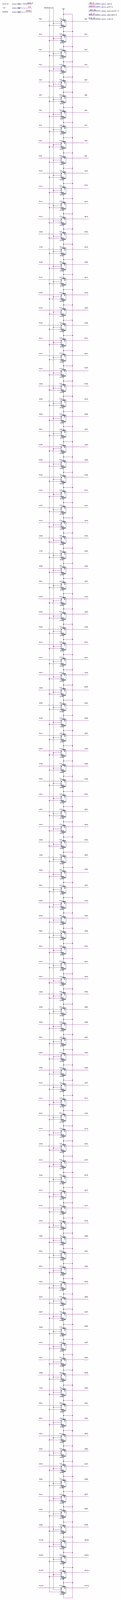
[diagram p0: schematic sheet, whole]
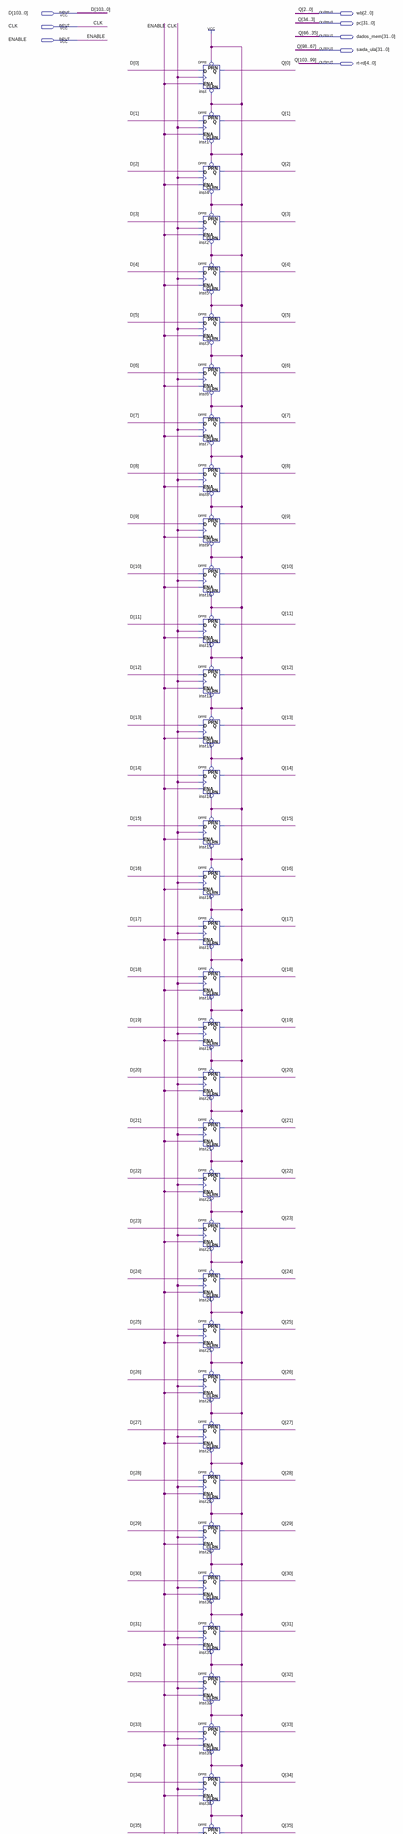
[diagram p1: schematic sheet, upper part]
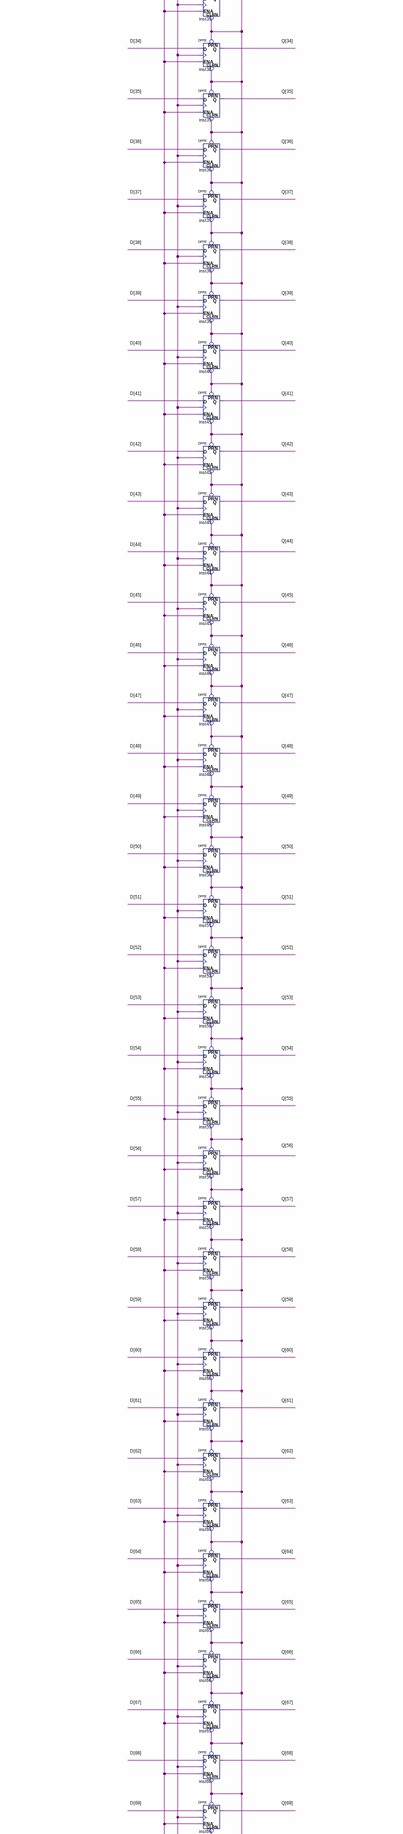
[diagram p2: schematic sheet, middle part]
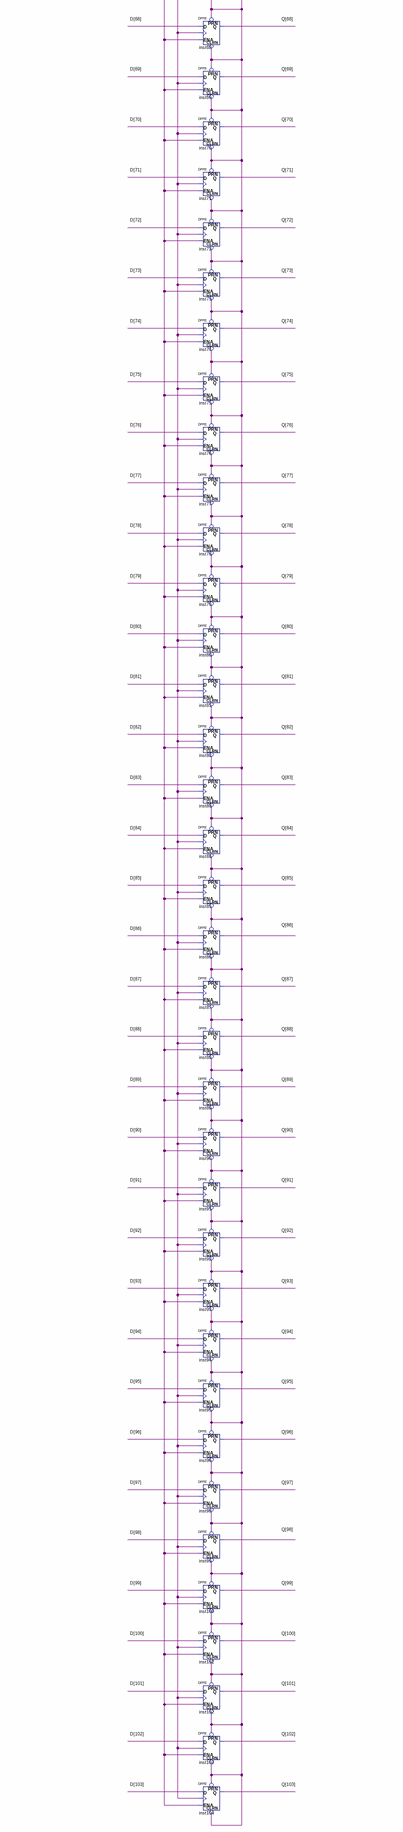
[diagram p3: schematic sheet, lower part]
// Quartus schematic REG104BMEMWB.bdf as structural Verilog: 104 symbols, 8 pins
module REG104BMEMWB (
  input  [103:0] D,
  input  CLK,
  input  ENABLE,
  output [2:0] wb,
  output [31:0] pc,
  output [31:0] dados_mem,
  output [31:0] saida_ula,
  output [4:0] \rt-rd 
);

  DFFE inst (.PRN(1'b1), .CLRN(1'b1), .D(D[0]), .CLK(CLK), .ENA(ENABLE), .Q(wb[0]));
  DFFE inst1 (.PRN(1'b1), .CLRN(1'b1), .D(D[1]), .CLK(CLK), .ENA(ENABLE), .Q(wb[1]));
  DFFE inst4 (.PRN(1'b1), .CLRN(1'b1), .D(D[2]), .CLK(CLK), .ENA(ENABLE), .Q(wb[2]));
  DFFE inst2 (.PRN(1'b1), .CLRN(1'b1), .D(D[3]), .CLK(CLK), .ENA(ENABLE), .Q(pc[0]));
  DFFE inst5 (.PRN(1'b1), .CLRN(1'b1), .D(D[4]), .CLK(CLK), .ENA(ENABLE), .Q(pc[1]));
  DFFE inst3 (.PRN(1'b1), .CLRN(1'b1), .D(D[5]), .CLK(CLK), .ENA(ENABLE), .Q(pc[2]));
  DFFE inst6 (.PRN(1'b1), .CLRN(1'b1), .D(D[6]), .CLK(CLK), .ENA(ENABLE), .Q(pc[3]));
  DFFE inst7 (.PRN(1'b1), .CLRN(1'b1), .D(D[7]), .CLK(CLK), .ENA(ENABLE), .Q(pc[4]));
  DFFE inst8 (.PRN(1'b1), .CLRN(1'b1), .D(D[8]), .CLK(CLK), .ENA(ENABLE), .Q(pc[5]));
  DFFE inst9 (.PRN(1'b1), .CLRN(1'b1), .D(D[9]), .CLK(CLK), .ENA(ENABLE), .Q(pc[6]));
  DFFE inst10 (.PRN(1'b1), .CLRN(1'b1), .D(D[10]), .CLK(CLK), .ENA(ENABLE), .Q(pc[7]));
  DFFE inst11 (.PRN(1'b1), .CLRN(1'b1), .D(D[11]), .CLK(CLK), .ENA(ENABLE), .Q(pc[8]));
  DFFE inst12 (.PRN(1'b1), .CLRN(1'b1), .D(D[12]), .CLK(CLK), .ENA(ENABLE), .Q(pc[9]));
  DFFE inst13 (.PRN(1'b1), .CLRN(1'b1), .D(D[13]), .CLK(CLK), .ENA(ENABLE), .Q(pc[10]));
  DFFE inst14 (.PRN(1'b1), .CLRN(1'b1), .D(D[14]), .CLK(CLK), .ENA(ENABLE), .Q(pc[11]));
  DFFE inst15 (.PRN(1'b1), .CLRN(1'b1), .D(D[15]), .CLK(CLK), .ENA(ENABLE), .Q(pc[12]));
  DFFE inst16 (.PRN(1'b1), .CLRN(1'b1), .D(D[16]), .CLK(CLK), .ENA(ENABLE), .Q(pc[13]));
  DFFE inst17 (.PRN(1'b1), .CLRN(1'b1), .D(D[17]), .CLK(CLK), .ENA(ENABLE), .Q(pc[14]));
  DFFE inst18 (.PRN(1'b1), .CLRN(1'b1), .D(D[18]), .CLK(CLK), .ENA(ENABLE), .Q(pc[15]));
  DFFE inst19 (.PRN(1'b1), .CLRN(1'b1), .D(D[19]), .CLK(CLK), .ENA(ENABLE), .Q(pc[16]));
  DFFE inst20 (.PRN(1'b1), .CLRN(1'b1), .D(D[20]), .CLK(CLK), .ENA(ENABLE), .Q(pc[17]));
  DFFE inst21 (.PRN(1'b1), .CLRN(1'b1), .D(D[21]), .CLK(CLK), .ENA(ENABLE), .Q(pc[18]));
  DFFE inst22 (.PRN(1'b1), .CLRN(1'b1), .D(D[22]), .CLK(CLK), .ENA(ENABLE), .Q(pc[19]));
  DFFE inst23 (.PRN(1'b1), .CLRN(1'b1), .D(D[23]), .CLK(CLK), .ENA(ENABLE), .Q(pc[20]));
  DFFE inst24 (.PRN(1'b1), .CLRN(1'b1), .D(D[24]), .CLK(CLK), .ENA(ENABLE), .Q(pc[21]));
  DFFE inst25 (.PRN(1'b1), .CLRN(1'b1), .D(D[25]), .CLK(CLK), .ENA(ENABLE), .Q(pc[22]));
  DFFE inst26 (.PRN(1'b1), .CLRN(1'b1), .D(D[26]), .CLK(CLK), .ENA(ENABLE), .Q(pc[23]));
  DFFE inst27 (.PRN(1'b1), .CLRN(1'b1), .D(D[27]), .CLK(CLK), .ENA(ENABLE), .Q(pc[24]));
  DFFE inst28 (.PRN(1'b1), .CLRN(1'b1), .D(D[28]), .CLK(CLK), .ENA(ENABLE), .Q(pc[25]));
  DFFE inst29 (.PRN(1'b1), .CLRN(1'b1), .D(D[29]), .CLK(CLK), .ENA(ENABLE), .Q(pc[26]));
  DFFE inst30 (.PRN(1'b1), .CLRN(1'b1), .D(D[30]), .CLK(CLK), .ENA(ENABLE), .Q(pc[27]));
  DFFE inst31 (.PRN(1'b1), .CLRN(1'b1), .D(D[31]), .CLK(CLK), .ENA(ENABLE), .Q(pc[28]));
  DFFE inst32 (.PRN(1'b1), .CLRN(1'b1), .D(D[32]), .CLK(CLK), .ENA(ENABLE), .Q(pc[29]));
  DFFE inst33 (.PRN(1'b1), .CLRN(1'b1), .D(D[33]), .CLK(CLK), .ENA(ENABLE), .Q(pc[30]));
  DFFE inst34 (.PRN(1'b1), .CLRN(1'b1), .D(D[34]), .CLK(CLK), .ENA(ENABLE), .Q(pc[31]));
  DFFE inst35 (.PRN(1'b1), .CLRN(1'b1), .D(D[35]), .CLK(CLK), .ENA(ENABLE), .Q(dados_mem[0]));
  DFFE inst36 (.PRN(1'b1), .CLRN(1'b1), .D(D[36]), .CLK(CLK), .ENA(ENABLE), .Q(dados_mem[1]));
  DFFE inst37 (.PRN(1'b1), .CLRN(1'b1), .D(D[37]), .CLK(CLK), .ENA(ENABLE), .Q(dados_mem[2]));
  DFFE inst38 (.PRN(1'b1), .CLRN(1'b1), .D(D[38]), .CLK(CLK), .ENA(ENABLE), .Q(dados_mem[3]));
  DFFE inst39 (.PRN(1'b1), .CLRN(1'b1), .D(D[39]), .CLK(CLK), .ENA(ENABLE), .Q(dados_mem[4]));
  DFFE inst40 (.PRN(1'b1), .CLRN(1'b1), .D(D[40]), .CLK(CLK), .ENA(ENABLE), .Q(dados_mem[5]));
  DFFE inst41 (.PRN(1'b1), .CLRN(1'b1), .D(D[41]), .CLK(CLK), .ENA(ENABLE), .Q(dados_mem[6]));
  DFFE inst42 (.PRN(1'b1), .CLRN(1'b1), .D(D[42]), .CLK(CLK), .ENA(ENABLE), .Q(dados_mem[7]));
  DFFE inst43 (.PRN(1'b1), .CLRN(1'b1), .D(D[43]), .CLK(CLK), .ENA(ENABLE), .Q(dados_mem[8]));
  DFFE inst44 (.PRN(1'b1), .CLRN(1'b1), .D(D[44]), .CLK(CLK), .ENA(ENABLE), .Q(dados_mem[9]));
  DFFE inst45 (.PRN(1'b1), .CLRN(1'b1), .D(D[45]), .CLK(CLK), .ENA(ENABLE), .Q(dados_mem[10]));
  DFFE inst46 (.PRN(1'b1), .CLRN(1'b1), .D(D[46]), .CLK(CLK), .ENA(ENABLE), .Q(dados_mem[11]));
  DFFE inst47 (.PRN(1'b1), .CLRN(1'b1), .D(D[47]), .CLK(CLK), .ENA(ENABLE), .Q(dados_mem[12]));
  DFFE inst48 (.PRN(1'b1), .CLRN(1'b1), .D(D[48]), .CLK(CLK), .ENA(ENABLE), .Q(dados_mem[13]));
  DFFE inst49 (.PRN(1'b1), .CLRN(1'b1), .D(D[49]), .CLK(CLK), .ENA(ENABLE), .Q(dados_mem[14]));
  DFFE inst50 (.PRN(1'b1), .CLRN(1'b1), .D(D[50]), .CLK(CLK), .ENA(ENABLE), .Q(dados_mem[15]));
  DFFE inst51 (.PRN(1'b1), .CLRN(1'b1), .D(D[51]), .CLK(CLK), .ENA(ENABLE), .Q(dados_mem[16]));
  DFFE inst52 (.PRN(1'b1), .CLRN(1'b1), .D(D[52]), .CLK(CLK), .ENA(ENABLE), .Q(dados_mem[17]));
  DFFE inst53 (.PRN(1'b1), .CLRN(1'b1), .D(D[53]), .CLK(CLK), .ENA(ENABLE), .Q(dados_mem[18]));
  DFFE inst54 (.PRN(1'b1), .CLRN(1'b1), .D(D[54]), .CLK(CLK), .ENA(ENABLE), .Q(dados_mem[19]));
  DFFE inst55 (.PRN(1'b1), .CLRN(1'b1), .D(D[55]), .CLK(CLK), .ENA(ENABLE), .Q(dados_mem[20]));
  DFFE inst56 (.PRN(1'b1), .CLRN(1'b1), .D(D[56]), .CLK(CLK), .ENA(ENABLE), .Q(dados_mem[21]));
  DFFE inst57 (.PRN(1'b1), .CLRN(1'b1), .D(D[57]), .CLK(CLK), .ENA(ENABLE), .Q(dados_mem[22]));
  DFFE inst58 (.PRN(1'b1), .CLRN(1'b1), .D(D[58]), .CLK(CLK), .ENA(ENABLE), .Q(dados_mem[23]));
  DFFE inst59 (.PRN(1'b1), .CLRN(1'b1), .D(D[59]), .CLK(CLK), .ENA(ENABLE), .Q(dados_mem[24]));
  DFFE inst60 (.PRN(1'b1), .CLRN(1'b1), .D(D[60]), .CLK(CLK), .ENA(ENABLE), .Q(dados_mem[25]));
  DFFE inst61 (.PRN(1'b1), .CLRN(1'b1), .D(D[61]), .CLK(CLK), .ENA(ENABLE), .Q(dados_mem[26]));
  DFFE inst62 (.PRN(1'b1), .CLRN(1'b1), .D(D[62]), .CLK(CLK), .ENA(ENABLE), .Q(dados_mem[27]));
  DFFE inst63 (.PRN(1'b1), .CLRN(1'b1), .D(D[63]), .CLK(CLK), .ENA(ENABLE), .Q(dados_mem[28]));
  DFFE inst64 (.PRN(1'b1), .CLRN(1'b1), .D(D[64]), .CLK(CLK), .ENA(ENABLE), .Q(dados_mem[29]));
  DFFE inst65 (.PRN(1'b1), .CLRN(1'b1), .D(D[65]), .CLK(CLK), .ENA(ENABLE), .Q(dados_mem[30]));
  DFFE inst66 (.PRN(1'b1), .CLRN(1'b1), .D(D[66]), .CLK(CLK), .ENA(ENABLE), .Q(dados_mem[31]));
  DFFE inst67 (.PRN(1'b1), .CLRN(1'b1), .D(D[67]), .CLK(CLK), .ENA(ENABLE), .Q(saida_ula[0]));
  DFFE inst68 (.PRN(1'b1), .CLRN(1'b1), .D(D[68]), .CLK(CLK), .ENA(ENABLE), .Q(saida_ula[1]));
  DFFE inst69 (.PRN(1'b1), .CLRN(1'b1), .D(D[69]), .CLK(CLK), .ENA(ENABLE), .Q(saida_ula[2]));
  DFFE inst70 (.PRN(1'b1), .CLRN(1'b1), .D(D[70]), .CLK(CLK), .ENA(ENABLE), .Q(saida_ula[3]));
  DFFE inst71 (.PRN(1'b1), .CLRN(1'b1), .D(D[71]), .CLK(CLK), .ENA(ENABLE), .Q(saida_ula[4]));
  DFFE inst72 (.PRN(1'b1), .CLRN(1'b1), .D(D[72]), .CLK(CLK), .ENA(ENABLE), .Q(saida_ula[5]));
  DFFE inst73 (.PRN(1'b1), .CLRN(1'b1), .D(D[73]), .CLK(CLK), .ENA(ENABLE), .Q(saida_ula[6]));
  DFFE inst74 (.PRN(1'b1), .CLRN(1'b1), .D(D[74]), .CLK(CLK), .ENA(ENABLE), .Q(saida_ula[7]));
  DFFE inst75 (.PRN(1'b1), .CLRN(1'b1), .D(D[75]), .CLK(CLK), .ENA(ENABLE), .Q(saida_ula[8]));
  DFFE inst76 (.PRN(1'b1), .CLRN(1'b1), .D(D[76]), .CLK(CLK), .ENA(ENABLE), .Q(saida_ula[9]));
  DFFE inst77 (.PRN(1'b1), .CLRN(1'b1), .D(D[77]), .CLK(CLK), .ENA(ENABLE), .Q(saida_ula[10]));
  DFFE inst78 (.PRN(1'b1), .CLRN(1'b1), .D(D[78]), .CLK(CLK), .ENA(ENABLE), .Q(saida_ula[11]));
  DFFE inst79 (.PRN(1'b1), .CLRN(1'b1), .D(D[79]), .CLK(CLK), .ENA(ENABLE), .Q(saida_ula[12]));
  DFFE inst80 (.PRN(1'b1), .CLRN(1'b1), .D(D[80]), .CLK(CLK), .ENA(ENABLE), .Q(saida_ula[13]));
  DFFE inst81 (.PRN(1'b1), .CLRN(1'b1), .D(D[81]), .CLK(CLK), .ENA(ENABLE), .Q(saida_ula[14]));
  DFFE inst82 (.PRN(1'b1), .CLRN(1'b1), .D(D[82]), .CLK(CLK), .ENA(ENABLE), .Q(saida_ula[15]));
  DFFE inst83 (.PRN(1'b1), .CLRN(1'b1), .D(D[83]), .CLK(CLK), .ENA(ENABLE), .Q(saida_ula[16]));
  DFFE inst84 (.PRN(1'b1), .CLRN(1'b1), .D(D[84]), .CLK(CLK), .ENA(ENABLE), .Q(saida_ula[17]));
  DFFE inst85 (.PRN(1'b1), .CLRN(1'b1), .D(D[85]), .CLK(CLK), .ENA(ENABLE), .Q(saida_ula[18]));
  DFFE inst86 (.PRN(1'b1), .CLRN(1'b1), .D(D[86]), .CLK(CLK), .ENA(ENABLE), .Q(saida_ula[19]));
  DFFE inst87 (.PRN(1'b1), .CLRN(1'b1), .D(D[87]), .CLK(CLK), .ENA(ENABLE), .Q(saida_ula[20]));
  DFFE inst88 (.PRN(1'b1), .CLRN(1'b1), .D(D[88]), .CLK(CLK), .ENA(ENABLE), .Q(saida_ula[21]));
  DFFE inst89 (.PRN(1'b1), .CLRN(1'b1), .D(D[89]), .CLK(CLK), .ENA(ENABLE), .Q(saida_ula[22]));
  DFFE inst90 (.PRN(1'b1), .CLRN(1'b1), .D(D[90]), .CLK(CLK), .ENA(ENABLE), .Q(saida_ula[23]));
  DFFE inst91 (.PRN(1'b1), .CLRN(1'b1), .D(D[91]), .CLK(CLK), .ENA(ENABLE), .Q(saida_ula[24]));
  DFFE inst92 (.PRN(1'b1), .CLRN(1'b1), .D(D[92]), .CLK(CLK), .ENA(ENABLE), .Q(saida_ula[25]));
  DFFE inst93 (.PRN(1'b1), .CLRN(1'b1), .D(D[93]), .CLK(CLK), .ENA(ENABLE), .Q(saida_ula[26]));
  DFFE inst94 (.PRN(1'b1), .CLRN(1'b1), .D(D[94]), .CLK(CLK), .ENA(ENABLE), .Q(saida_ula[27]));
  DFFE inst95 (.PRN(1'b1), .CLRN(1'b1), .D(D[95]), .CLK(CLK), .ENA(ENABLE), .Q(saida_ula[28]));
  DFFE inst96 (.PRN(1'b1), .CLRN(1'b1), .D(D[96]), .CLK(CLK), .ENA(ENABLE), .Q(saida_ula[29]));
  DFFE inst98 (.PRN(1'b1), .CLRN(1'b1), .D(D[97]), .CLK(CLK), .ENA(ENABLE), .Q(saida_ula[30]));
  DFFE inst99 (.PRN(1'b1), .CLRN(1'b1), .D(D[98]), .CLK(CLK), .ENA(ENABLE), .Q(saida_ula[31]));
  DFFE inst100 (.PRN(1'b1), .CLRN(1'b1), .D(D[99]), .CLK(CLK), .ENA(ENABLE), .Q(\rt-rd [0]));
  DFFE inst101 (.PRN(1'b1), .CLRN(1'b1), .D(D[100]), .CLK(CLK), .ENA(ENABLE), .Q(\rt-rd [1]));
  DFFE inst102 (.PRN(1'b1), .CLRN(1'b1), .D(D[101]), .CLK(CLK), .ENA(ENABLE), .Q(\rt-rd [2]));
  DFFE inst103 (.PRN(1'b1), .CLRN(1'b1), .D(D[102]), .CLK(CLK), .ENA(ENABLE), .Q(\rt-rd [3]));
  DFFE inst104 (.PRN(1'b1), .CLRN(1'b1), .D(D[103]), .CLK(CLK), .ENA(ENABLE), .Q(\rt-rd [4]));

  // Other names for the same wires on the sheet: Q[103:0] = {\rt-rd , saida_ula, dados_mem, pc, wb}
endmodule
